# Altium schematic sheet DMX8x8A-v1.SchDoc
size C; Organization: Altium Limited; Address1: L3, 12a Rodborough Rd; Address2: Frenchs Forest; Address3: NSW; Address4: Australia 2086
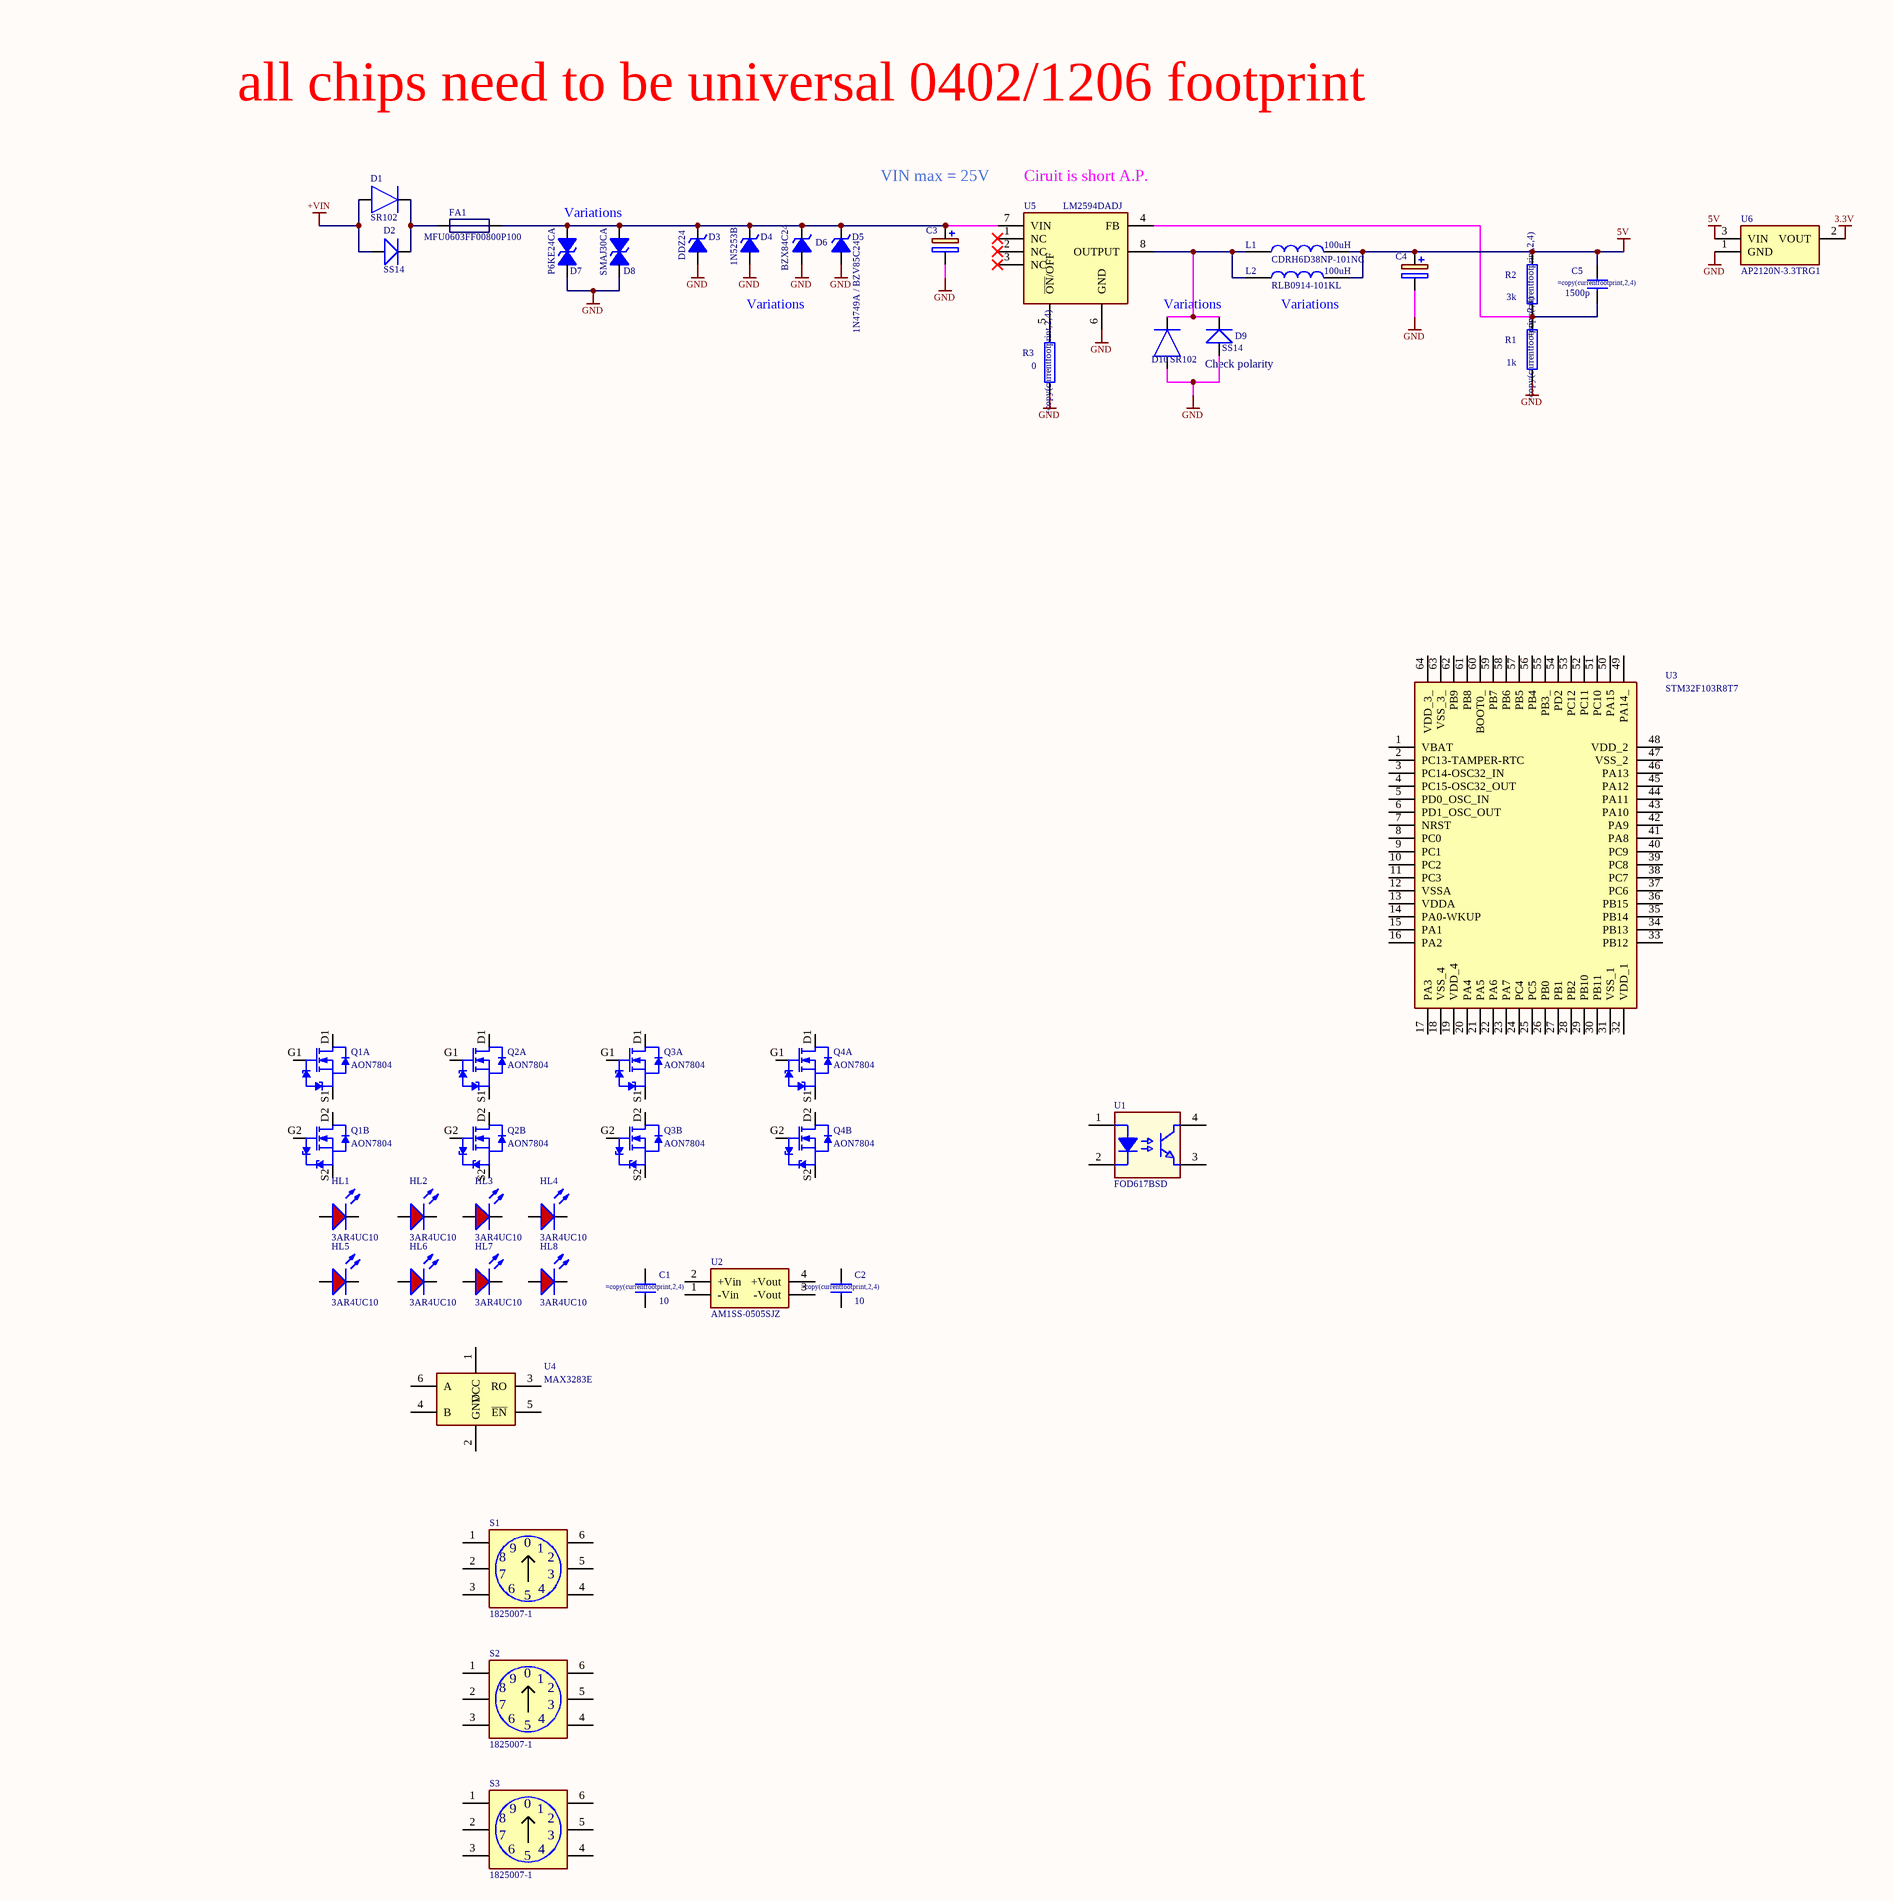
[diagram p0: DMX8x8A-v1.SchDoc]

## Parts
C1  value 10  [C1206_r]  (hidden comment: 10 50V 5%)
C2  value 10  [C1206_r]  (hidden comment: 10 50V 5%)
C3  35ZL470MEFC10X20  [CAPPRD500W60D1025H1750]  (value not drawn)
C4  35ZL470MEFC10X20  [CAPPRD500W60D1025H1750]  (value not drawn)
C5  value 1500p  [C0603_r]  (hidden comment: 1500p 25V 20%)
D1  SR102  [DO-204AL (DO-41)]
D2  SS14
D3  DDZ24  [SOD323F]
D4  1N5253B  [DO-204AH (DO-35).SLDPRT]
D5  1N4749A / BZV85C24  [DO-204AL (DO-41)]
D6  BZX84C24  [SOT-23-3 (3)]
D7  P6KE24CA  [DIOAD1910W90L670D310 (DO-15)]
D8  SMAJ30CA  [DO-214AC (SMA) biplar]
D9  SS14  Note: Check polarity  [DO-214AC (SMA)]
D10  SR102  [DO-204AL (DO-41)]
FA1  MFU0603FF00800P100  [FUSC1608X55N]
HL1  3AR4UC10  [LED-2pin 2.54mm]
HL2  3AR4UC10  [LED-2pin 2.54mm]
HL3  3AR4UC10  [LED-2pin 2.54mm]
HL4  3AR4UC10  [LED-2pin 2.54mm]
HL5  3AR4UC10  [LED-2pin 2.54mm]
HL6  3AR4UC10  [LED-2pin 2.54mm]
HL7  3AR4UC10  [LED-2pin 2.54mm]
HL8  3AR4UC10  [LED-2pin 2.54mm]
L1  CDRH6D38NP-101NC  value 100uH  [INDPM6767X400N]
L2  RLB0914-101KL  value 100uH  [RLB0914]
Q1  AON7804  [AON7804]  (parts A,B of 2)
Q2  AON7804  [AON7804]  (parts A,B of 2)
Q3  AON7804  [AON7804]  (parts A,B of 2)
Q4  AON7804  [AON7804]  (parts A,B of 2)
R1  value 1k  [R0402_r]  (hidden comment: 1k 5%)
R2  value 3k  [R0402_r]  (hidden comment: 3k 5%)
R3  value 0  [R0402_r]  (hidden comment: 0 5%)
S1  1825007-1  [1825007-1]
S2  1825007-1  [1825007-1]
S3  1825007-1  [1825007-1]
U1  FOD617BSD  [FOD617BSD]
U2  AM1SS-0505SJZ  [AM1S]
U3  STM32F103R8T7  [LQFP64 (QFP50P1200X1200X160-64N)]
U4  MAX3283E  [SOT23-6 (SOT95P280X145-6N)]
U5  LM2594DADJ  [SOIC-8]
U6  AP2120N-3.3TRG1  [SOT-23-3 (3)]

## Nets
3.3V: U6.2(VOUT)
5V: C4.1(+) C5.2 L1.2 L2.2 R2.2(BOT) U6.3(VIN)
+VIN: D1.2(A) D2.1
GND: C3.2(-) C4.2(-) D3.2(A) D4.2 D5.2 D6.1 D7.1 D8.1 D9.1 D10.2(A) R1.1(TOP) R3.1(TOP) U5.6(GND) U6.1(GND)
NetC3_1: C3.1(+) D3.1(C) D4.1 D5.1 D6.3 D7.2 D8.2 FA1.2 U5.7(VIN)
NetC5_1: C5.1 R1.2(BOT) R2.1(TOP) U5.4(FB)
NetD1_1: D1.1(K) D2.2 FA1.1
NetD9_2: D9.2 D10.1(K) L1.1 L2.1 U5.8(OUTPUT)
NetR3_2: R3.2(BOT) U5.5(~{ON}/OFF)

Not connected (* = marked no-connect by the designer): C1 1 2; C2 1 2; HL1 1 2; HL2 1 2; HL3 1 2; HL4 1 2; HL5 1 2; HL6 1 2; HL7 1 2; HL8 1 2; Q1 D1 D2 G1 G2(G1) S1 S2(S1); Q2 D1 D2 G1 G2(G1) S1 S2(S1); Q3 D1 D2 G1 G2(G1) S1 S2(S1); Q4 D1 D2 G1 G2(G1) S1 S2(S1); S1 1 2 3 4 5 6; S2 1 2 3 4 5 6; S3 1 2 3 4 5 6; U1 1(A) 2(C) 3(E) 4(C); U2 1(-Vin) 2(+Vin) 3(-Vout) 4(+Vout); U3 1(VBAT) 2(PC13-TAMPER-RTC) 3(PC14-OSC32_IN) 4(PC15-OSC32_OUT) 5(PD0_OSC_IN) 6(PD1_OSC_OUT) 7(NRST) 8(PC0) 9(PC1) 10(PC2) 11(PC3) 12(VSSA) 13(VDDA) 14(PA0-WKUP) 15(PA1) 16(PA2) 17(PA3) 18(VSS_4) 19(VDD_4) 20(PA4) 21(PA5) 22(PA6) 23(PA7) 24(PC4) 25(PC5) 26(PB0) 27(PB1) 28(PB2) 29(PB10) 30(PB11) 31(VSS_1) 32(VDD_1) 33(PB12) 34(PB13) 35(PB14) 36(PB15) 37(PC6) 38(PC7) 39(PC8) 40(PC9) 41(PA8) 42(PA9) 43(PA10) 44(PA11) 45(PA12) 46(PA13) 47(VSS_2) 48(VDD_2) 49(PA14_) 50(PA15) 51(PC10) 52(PC11) 53(PC12) 54(PD2) 55(PB3_) 56(PB4) 57(PB5) 58(PB6) 59(PB7) 60(BOOT0_) 61(PB8) 62(PB9) 63(VSS_3_) 64(VDD_3_); U4 1(VCC) 2(GND) 3(RO) 4(B) 5(~{EN}) 6(A); U5 1(NC)* 2(NC)* 3(NC)*

## Notes on the sheet
- all chips need to be universal 0402/1206 footprint
- Variations
- VIN max = 25V
- (near U5) Ciruit is short A.P.
- (near L2) Variations
- Title
- Size:
- Date:
- File:
- C
- Number:
- Time:
- Revision:
- Sheet
- of
- (in symbol 1825007-1) 0; 9; 8; 7

## Library data of the parts
C1 C2 = Ceramic SMD Cap_R: Ceramic Chip Capacitor; Value2: 50V 5%; SMD/TH: SMD; ComponentLink1Description: Local Datasheet; ComponentLink1URL: V:\Libraries\Passives\RLC\Capacitors\AVXShortForm.pdf; HelpURL: https://www.mouser.com/catalog/supplier/library/AVXShortForm.pdf; Footprint: =copy(currentfootprint,2,4)
C3 C4 = 35ZL470MEFC10X20: Radial Lead Aluminum Electrolytic Capacitors; SMD/TH: TH; HelpURL: http://www.rubycon.co.jp/en/catalog/e_pdfs/aluminum/e_zl.pdf
C5 = Ceramic SMD Cap_R: Ceramic Chip Capacitor; Value2: 25V 20%; ComponentLink1Description: Local Datasheet; ComponentLink1URL: V:\Libraries\Passives\RLC\Capacitors\AVXShortForm.pdf; HelpURL: https://www.mouser.com/catalog/supplier/library/AVXShortForm.pdf; Footprint: =copy(currentfootprint,2,4)
D1 D10 = SR102: Schottky Barrier Rectifier; SMD/TH: TH; HelpURL: https://ru.mouser.com/Semiconductors/Discrete-Semiconductors/Diodes-Rectifiers/Schottky-Diodes-Rectifiers/Datasheets/_/N-awhng?keyword=SR103
D2 D9 = SS12: Surface Mount Schottky Barrier Rectifier; SMD/TH: SMD; HelpURL: http://www.vishay.com/docs/88746/ss12.pdf
D3 = DDZ: Zener 0.5w SOD323F; Mfr: Diodes Incorporated; SMD/TH: SMD; Name1: 24; HelpURL: https://www.diodes.com/assets/Datasheets/ds31987.pdf
D4 = 1N5253B: Zener DO-35; Mfr: ON Semi; SMD/TH: SMD; HelpURL: https://www.onsemi.com/pub/Collateral/1N5221B-D.PDF
D5 = Zener DO-41: SMD/TH: TH; HelpURL: https://assets.nexperia.com/documents/data-sheet/1N4728A_SER.pdf
D6 = BZX84C13LT1G: Zener regulator, 27V; Mfr: ON Semi; HelpURL: https://www.onsemi.com/pub/Collateral/BZX84C2V4LT1-D.PDF; ComponentLink1Description: Local Datasheet; ComponentLink1URL: V:\Libraries\Discrete\Diodes\Doc\BZX84C2V4LT1-D.PDF
D7 = P6KE: TVS Axial 600W Unipolar 24V; SMD/TH: TH; HelpURL: https://m.littelfuse.com/~/media/electronics/datasheets/tvs_diodes/littelfuse_tvs_diode_p6ke_datasheet.pdf.pdf
D8 = SMAJ30CA: TVS Uni 30V; Mfr: ST; SMD/TH: SMD; HelpURL: https://www.st.com/resource/en/datasheet/smaj.pdf; ComponentLink1Description: Local Datasheet; ComponentLink1URL: V:\Libraries\Discrete\TVS\1724007.pdf
FA1 = Fuse MFU: Thin Film Chip Fuse; SMD/TH: SMD; HelpURL: http://www.vishay.com/docs/28747/mfuserie.pdf
HL1-HL8 = 3AR4UC10: LED 3mm Red; SMD/TH: TH; HelpURL: http://www.triatron.ru/upload/catalog_photo/elements/pdf/006531.pdf
L1 = CDRH6D38NP: SMD Power Inductor 100uH 0.65A 265mOhms; Mfr: Sumida; HelpURL: http://products.sumida.com/products/pdf/CDRH6D38.pdf; SMD/TH: SMD
L2 = RLB0914-101KL: Radial Fixed Through Hole Inductor 100uH Bourns 100 uH +/-10%; SMD/TH: TH; HelpURL: https://www.bourns.com/pdfs/rlb.pdf
Q1-Q4 = AON7804: 30V Dual N-Channel MOSFET; SMD/TH: SMD; HelpURL: http://aosmd.com/res/data_sheets/AON7804.pdf; ComponentLink1Description: Drawing; ComponentLink1URL: http://aosmd.com/res/packaging_information/DFN3x3_8L_EP2_P.pdf
R1-R3 = SMD Res_R: Chip Resistor; HelpURL: http://www.vishay.com/docs/49252/_dbr_smd_resistor_product_overview_vmn_sg2189_1705.pdf; ComponentLink1Description: Local Datasheet; ComponentLink1URL: V:\Libraries\Passives\Resistors\_dbr_smd_resistor_product_overview_vmn_sg2189_1705.pdf; Value2: 5%; Footprint: =copy(currentfootprint,2,4)
S1-S3 = 1825007-1: Alcoswitch DIP, Rotary Switches, 10 Positions, Flush Actuator Style, Rotary Switch Style, Rotary DIP Switch Type, 10 Switches, Thermoplastic, Sealed; SMD/TH: TH; HelpURL: https://www.te.com/commerce/DocumentDelivery/DDEController?Action=showdoc&DocId=Customer+Drawing%7F1825007%7FA5%7Fpdf%7FEnglish%7FENG_CD_1825007_A5.pdf%7F1825007-1
U1 = FOD617BSD: 4-Pin High Operating Temperature / Phototransistor Optocouplers; Manufacturer_Name: ON Semiconductor; Manufacturer_Part_Number: FOD814; SMD/TH: TH; Datasheet Link: http://www.onsemi.com/pub/Collateral/FOD814-D.PDF; Height: 4.4mm; Mouser Part Number: 512-FOD814; Mouser Price/Stock: https://www.mouser.com/Search/Refine.aspx?Keyword=512-FOD814; RS Part Number: 7599311P; RS Price/Stock: http://uk.rs-online.com/web/p/products/7599311P; HelpURL: https://4donline.ihs.com/images/VipMasterIC/IC/FAIR/FAIRS24026/FAIRS24026-1.pdf?hkey=EC6BD57738AE6E33B588C5F9AD3CEFA7
U2 = AM1SS-0505SJZ: Isolated DC-DC Converter 1 Watt; Manufacturer_Name: aimtec; Manufacturer_Part_Number: AM1SS-1205S-NZ; SMD/TH: SMD; Datasheet Link: http://www.aimtec.com/site/Aimtec/files/Datasheet/HighResolution/am1ss-nz.pdf; Height: 10.16mm; HelpURL: http://www.aimtec.com/site/Aimtec/files/Datasheet/HighResolution/am1ss-nz.pdf
U3 = STM32F103R8T7: Medium-density performance line ARM®-based 32-bit MCU with 64 or 128 KB Flash, USB, CAN, 7 timers, 2 ADCs, 9 com. interfaces; Manufacturer_Name: STMicroelectronics; Allied_Number: 70391004; SMD/TH: SMD; Datasheet Link: http://docs-asia.electrocomponents.com/webdocs/0ed0/0900766b80ed015c.pdf; Height: 1.6mm; Manufacturer_Part_Number: STM32F103R8T7; Mouser Part Number: 511-STM32F103R8T7; Mouser Price/Stock: https://www.mouser.com/Search/Refine.aspx?Keyword=511-STM32F103R8T7; RS Part Number: 7239025P; RS Price/Stock: http://uk.rs-online.com/web/p/products/7239025P; Allied Price/Stock: http://www.alliedelec.com/stmicroelectronics-stm32f103r8t7/70391004/; HelpURL: https://www.st.com/resource/en/datasheet/stm32f103r8.pdf
U4 = MAX3283E: 15kV ESD-Protected 52Mbps, 3V to 5.5V, / SOT23 RS-485/RS-422 True Fail-Safe Receiver; Manufacturer_Name: Maxim Integrated; Manufacturer_Part_Number: MAX3283EAUT+T; SMD/TH: SMD; Datasheet Link: https://datasheets.maximintegrated.com/en/ds/MAX3280E-MAX3284E.pdf; Height: 1.45mm; Mouser Part Number: 700-MAX3283EAUTT; Mouser Price/Stock: https://www.mouser.com/Search/Refine.aspx?Keyword=700-MAX3283EAUTT; RS Part Number: 9237298; RS Price/Stock: https://uk.rs-online.com/web/p/products/9237298; HelpURL: https://datasheets.maximintegrated.com/en/ds/MAX3280E-MAX3284E.pdf
U5 = LM2594DADJ: 0.5 A, Step-Down Switching Regulator; Mfr: ON Semiconductor; SMD/TH: SMD; HelpURL: http://www.onsemi.com/pub/Collateral/LM2594-D.PDF
U6 = AP2120N-3.3TRG1: High Speed, Extremely Low Noise LDO Regulator; Manufacturer_Name: Diodes Inc.; Allied_Number: 70550990; SMD/TH: SMD; Datasheet Link: https://componentsearchengine.com/Datasheets/1/AP2120N-3.3TRG1.pdf; Height: 1.2mm; Manufacturer_Part_Number: AP2120N-3.3TRG1; Mouser Part Number: 621-AP2120N-3.3TRG1; Mouser Price/Stock: https://www.mouser.com/Search/Refine.aspx?Keyword=621-AP2120N-3.3TRG1; RS Part Number: 8287334P; RS Price/Stock: http://uk.rs-online.com/web/p/products/8287334P; Allied Price/Stock: https://www.alliedelec.com/diodesinc-ap2120n-3-3trg1/70550990/; HelpURL: https://www.diodes.com/assets/Datasheets/AP2120.pdf